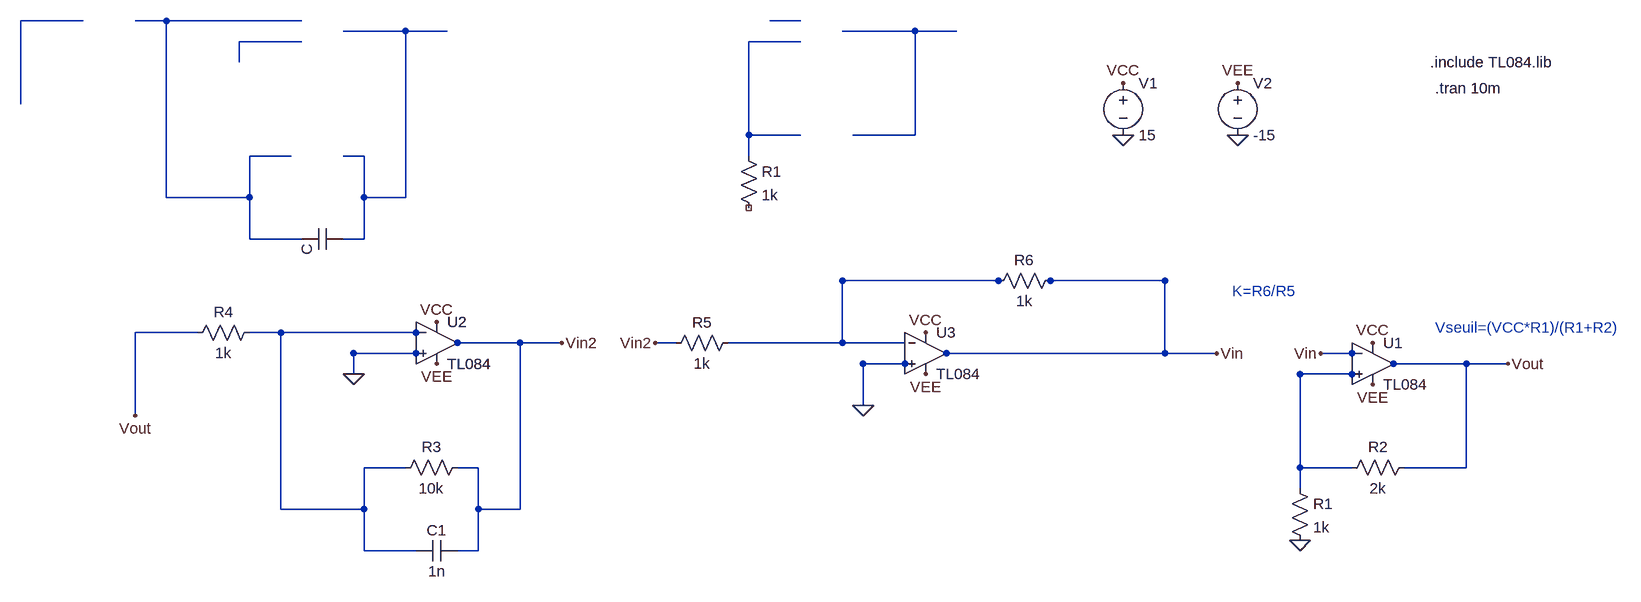
[diagram p0: schematic oscillo.asc]
oscillo.asc, the LTspice schematic file:
Version 4

SHEET 1 1840 792
WIRE -976 160 -1072 160
WIRE -848 160 -896 160
WIRE -640 160 -848 160
WIRE 128 160 80 160
WIRE -480 176 -576 176
WIRE -416 176 -480 176
WIRE 304 176 192 176
WIRE 368 176 304 176
WIRE -640 192 -736 192
WIRE 128 192 48 192
WIRE -736 224 -736 192
WIRE -1072 288 -1072 160
WIRE 48 336 48 192
WIRE 128 336 48 336
WIRE 304 336 304 176
WIRE 304 336 208 336
WIRE -656 368 -720 368
WIRE -544 368 -576 368
WIRE 48 368 48 336
WIRE -848 432 -848 160
WIRE -720 432 -720 368
WIRE -720 432 -848 432
WIRE -544 432 -544 368
WIRE -480 432 -480 176
WIRE -480 432 -544 432
WIRE -720 496 -720 432
WIRE -640 496 -720 496
WIRE -544 496 -544 432
WIRE -544 496 -576 496
WIRE 432 560 192 560
WIRE 688 560 512 560

SHEET 1 1840 1024
WIRE 432 560 192 560
WIRE 688 560 512 560
WIRE -800 640 -896 640
WIRE -672 640 -720 640
WIRE -464 640 -672 640
WIRE -304 656 -400 656
WIRE -240 656 -304 656
WIRE -64 656 -96 656
WIRE 192 656 192 560
WIRE 192 656 16 656
WIRE 288 656 192 656
WIRE -464 672 -560 672

WIRE 688 672 688 560
WIRE 688 672 352 672
WIRE 768 672 688 672
WIRE 976 672 928 672
WIRE 288 688 224 688
WIRE 1152 688 1040 688
WIRE 1216 688 1152 688
WIRE -560 704 -560 672
WIRE 976 704 896 704
WIRE 224 752 224 688

WIRE -464 672 -560 672
WIRE 688 672 688 560
WIRE 688 672 352 672
WIRE 768 672 688 672
WIRE 976 672 928 672
WIRE 288 688 224 688
WIRE 1152 688 1040 688
WIRE 1216 688 1152 688
WIRE -560 704 -560 672
WIRE 976 704 896 704
WIRE 224 752 224 688
WIRE -896 768 -896 640
WIRE -480 848 -544 848
WIRE -368 848 -400 848
WIRE 896 848 896 704
WIRE 976 848 896 848
WIRE 1152 848 1152 688
WIRE 1152 848 1056 848
WIRE 896 880 896 848
WIRE -672 912 -672 640
WIRE -544 912 -544 848
WIRE -544 912 -672 912
WIRE -368 912 -368 848
WIRE -304 912 -304 656
WIRE -304 912 -368 912
WIRE -544 976 -544 912
WIRE -464 976 -544 976
WIRE -368 976 -368 912
WIRE -368 976 -400 976
FLAG 624 336 0
FLAG 800 336 0
FLAG 624 256 VCC
FLAG 800 256 VEE

FLAG 1008 720 VEE
FLAG 1008 656 VCC
FLAG 928 672 Vin
FLAG 1216 688 Vout
FLAG -432 624 VCC
FLAG -432 688 VEE
FLAG -896 768 Vout
FLAG -240 656 Vin2
FLAG -560 704 0
FLAG 896 960 0


FLAG 224 752 0
FLAG 768 672 Vin
FLAG -96 656 Vin2
FLAG 320 640 VCC
FLAG 320 704 VEE

SYMBOL Opamps\\opamp2 1008 624 R0

SYMATTR InstName U1
SYMATTR Value TL084
SYMBOL voltage 624 240 R0
SYMATTR InstName V1
SYMATTR Value 15
SYMBOL voltage 800 240 R0
SYMATTR InstName V2
SYMATTR Value -15

SYMBOL res 1072 832 R90
WINDOW 0 0 56 VBottom 2
WINDOW 3 32 56 VTop 2
SYMATTR InstName R2
SYMATTR Value 2k

SYMBOL res 32 352 R0
SYMATTR InstName R1
SYMATTR Value 1k
SYMBOL Opamps\\opamp2 -432 592 R0
SYMATTR InstName U2
SYMATTR Value TL084
SYMBOL cap -576 480 R90

SYMBOL res 880 864 R0
SYMATTR InstName R1
SYMATTR Value 1k
SYMBOL Opamps\\opamp2 -432 592 R0
SYMATTR InstName U2
SYMATTR Value TL084
SYMBOL cap -400 960 R90

WINDOW 0 0 32 VBottom 2
WINDOW 3 32 32 VTop 2
SYMATTR InstName C1
SYMATTR Value 1n

SYMBOL res -384 832 R90
WINDOW 0 0 56 VBottom 2
WINDOW 3 32 56 VTop 2
SYMATTR InstName R3
SYMATTR Value 10k

SYMBOL res -704 624 R90
WINDOW 0 0 56 VBottom 2
WINDOW 3 32 56 VTop 2
SYMATTR InstName R4
SYMATTR Value 1k
SYMBOL res 32 640 R90
WINDOW 0 0 56 VBottom 2
WINDOW 3 32 56 VTop 2
SYMATTR InstName R5
SYMATTR Value 1k
SYMBOL res 528 544 R90
WINDOW 0 0 56 VBottom 2
WINDOW 3 32 56 VTop 2
SYMATTR InstName R6
SYMATTR Value 1k
SYMBOL Opamps\\opamp2 320 608 R0
SYMATTR InstName U3
SYMATTR Value TL084
TEXT 1096 224 Left 2 !.include TL084.lib
TEXT 1104 264 Left 2 !.tran 10m
TEXT 792 576 Left 2 ;K=R6/R5

TEXT 1104 632 Left 2 ;Vseuil=(VCC*R1)/(R1+R2)

The netlist it stands for:
* oscillo.asc
XU1 N010 Vin VCC VEE Vout TL084  ; pins In+ In- V+ V- OUT
V1 VCC 0 15
V2 VEE 0 -15
R2 Vout N010 2k
R1 N007 NC_01 1k
XU2 0 N009 VCC VEE Vin2 TL084  ; pins In+ In- V+ V- OUT
C§? N004 N002 C
R1 N010 0 1k
XU2 0 N009 VCC VEE Vin2 TL084  ; pins In+ In- V+ V- OUT
C1 Vin2 N009 1n
R3 Vin2 N009 10k
R4 N009 Vout 1k
R5 N008 Vin2 1k
R6 Vin N008 1k
XU3 0 N008 VCC VEE Vin TL084  ; pins In+ In- V+ V- OUT
.include TL084.lib
.tran 10m
* K=R6/R5
* Vseuil=(VCC*R1)/(R1+R2)
.backanno
.end